# EAGLE schematic power (EAGLE 6.4)
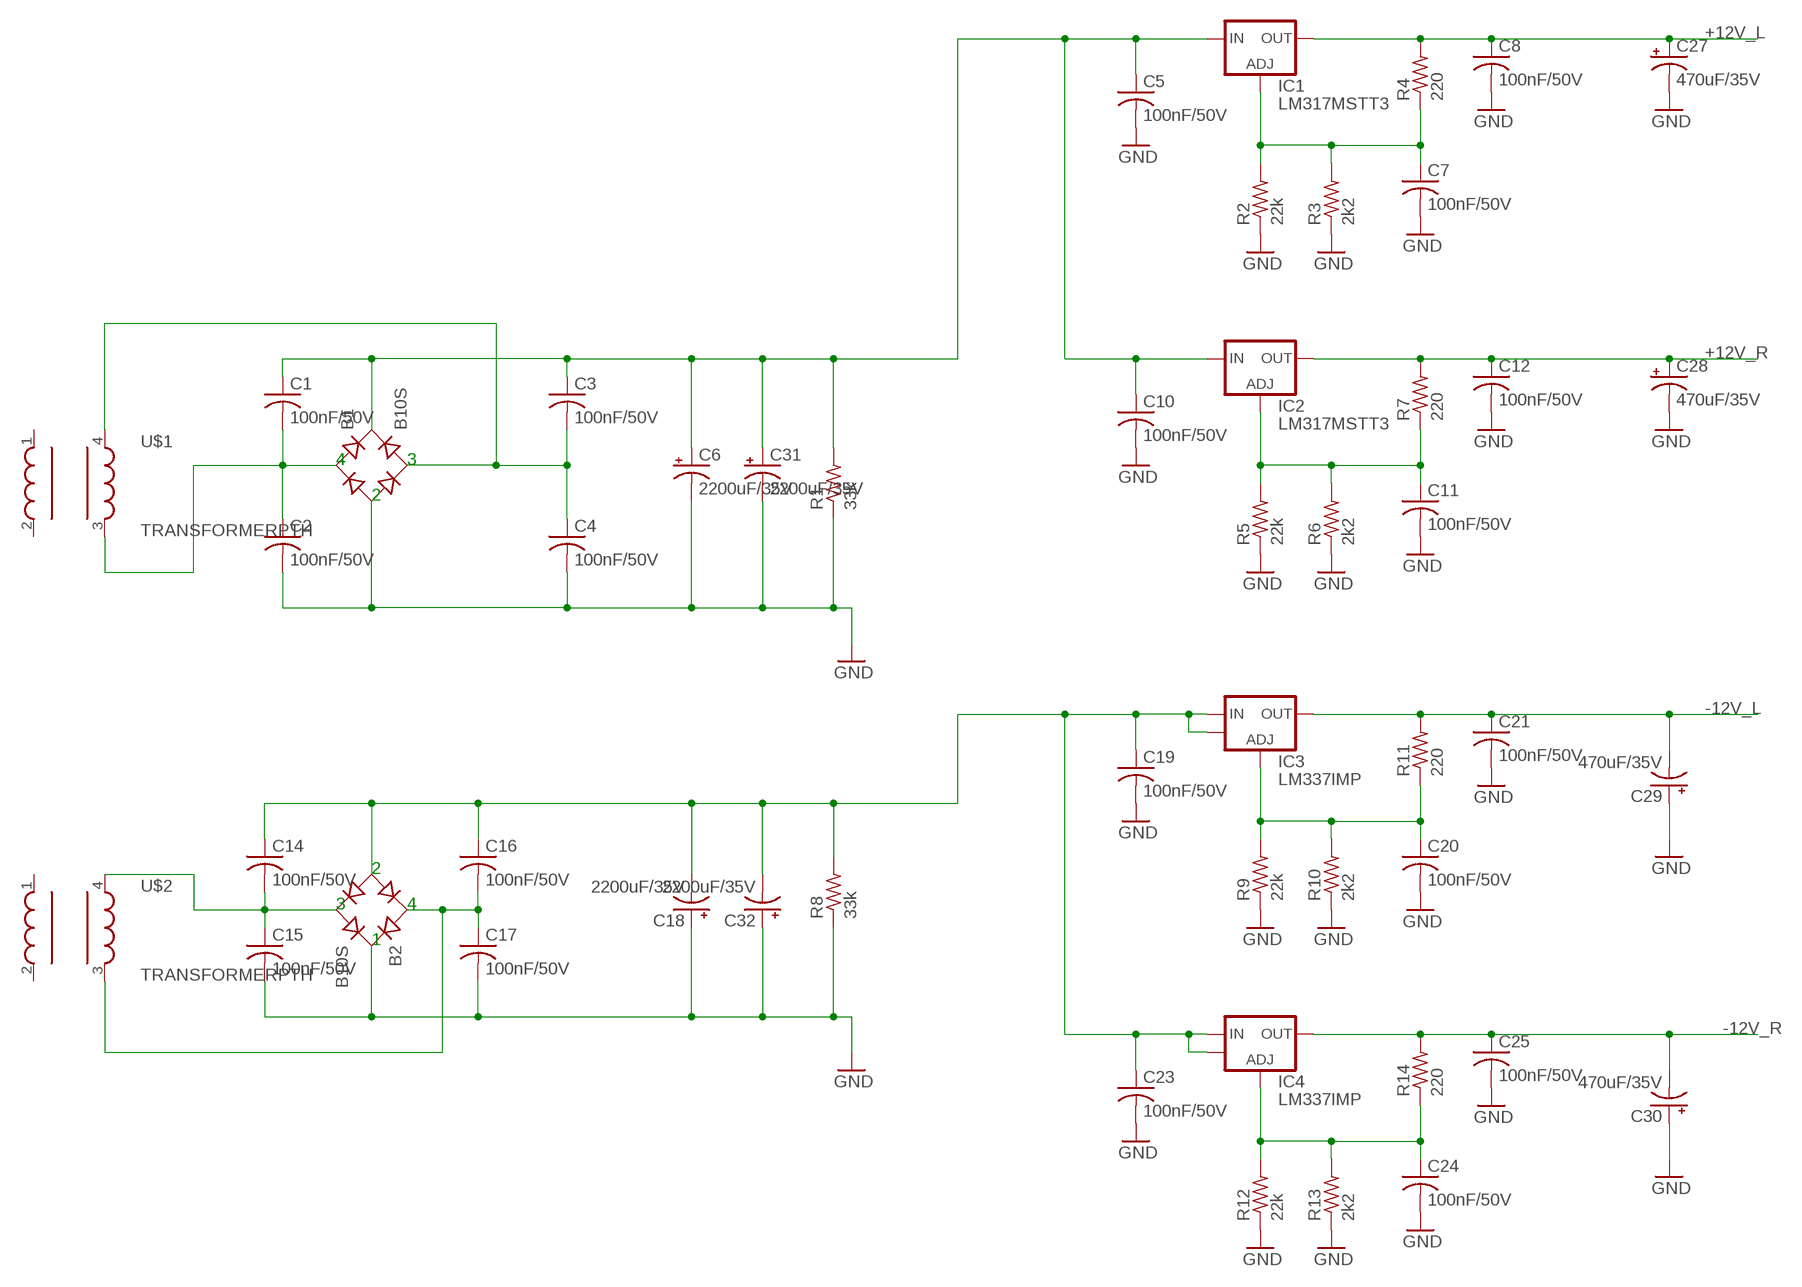
[diagram p0: schematic, sheet 1]

## Parts
B1  B10S  [MBS]
B2  B10S  [MBS]
C1  100nF/50V  C-USC0805  [C0805]
C2  100nF/50V  C-USC0805  [C0805]
C3  100nF/50V  C-USC0805  [C0805]
C4  100nF/50V  C-USC0805  [C0805]
C5  100nF/50V  C-USC0805  [C0805]
C6  2200uF/35V  CPOL-USE5-13  [E5-13]
C7  100nF/50V  C-USC0805  [C0805]
C8  100nF/50V  C-USC0805  [C0805]
C10  100nF/50V  C-USC0805  [C0805]
C11  100nF/50V  C-USC0805  [C0805]
C12  100nF/50V  C-USC0805  [C0805]
C14  100nF/50V  C-USC0805  [C0805]
C15  100nF/50V  C-USC0805  [C0805]
C16  100nF/50V  C-USC0805  [C0805]
C17  100nF/50V  C-USC0805  [C0805]
C18  2200uF/35V  CPOL-USE5-13  [E5-13]
C19  100nF/50V  C-USC0805  [C0805]
C20  100nF/50V  C-USC0805  [C0805]
C21  100nF/50V  C-USC0805  [C0805]
C23  100nF/50V  C-USC0805  [C0805]
C24  100nF/50V  C-USC0805  [C0805]
C25  100nF/50V  C-USC0805  [C0805]
C27  470uF/35V  CPOL-USE5-13  [E5-13]
C28  470uF/35V  CPOL-USE5-13  [E5-13]
C29  470uF/35V  CPOL-USE5-13  [E5-13]
C30  470uF/35V  CPOL-USE5-13  [E5-13]
C31  2200uF/35V  CPOL-USE5-13  [E5-13]
C32  2200uF/35V  CPOL-USE5-13  [E5-13]
IC1  LM317MSTT3  [SOT223]
IC2  LM317MSTT3  [SOT223]
IC3  LM337IMP  [SOT-223]
IC4  LM337IMP  [SOT-223]
R1  33k  R-US_M0805  [M0805]
R2  22k  R-US_M0805  [M0805]
R3  2k2  R-US_M0805  [M0805]
R4  220  R-US_M0805  [M0805]
R5  22k  R-US_M0805  [M0805]
R6  2k2  R-US_M0805  [M0805]
R7  220  R-US_M0805  [M0805]
R8  33k  R-US_M0805  [M0805]
R9  22k  R-US_M0805  [M0805]
R10  2k2  R-US_M0805  [M0805]
R11  220  R-US_M0805  [M0805]
R12  22k  R-US_M0805  [M0805]
R13  2k2  R-US_M0805  [M0805]
R14  220  R-US_M0805  [M0805]
U$1  TRANSFORMERPTH  [TRANSFORMER]
U$2  TRANSFORMERPTH  [TRANSFORMER]

## Nets
+12V_L: C8.1 C27.+ IC1.4(OUT) R4.2
+12V_R: C12.1 C28.+ IC2.4(OUT) R7.2
+VSS_NOREG: B1.+ C1.1 C3.1 C5.1 C6.+ C10.1 C31.+ IC1.3(IN) IC2.3(IN) R1.2
-12V_L: C21.1 C29.- IC3.3(OUT) R11.2
-12V_R: C25.1 C30.- IC4.3(OUT) R14.2
-VSS_NOREG: B2.- C14.1 C16.1 C18.- C19.1 C23.1 C32.- IC3.2(IN) IC3.4 IC4.2(IN) IC4.4 R8.2
GND: B1.- B2.+ C2.2 C4.2 C5.2 C6.- C7.2 C8.2 C10.2 C11.2 C12.2 C15.2 C17.2 C18.+ C19.2 C20.2 C21.2 C23.2 C24.2 C25.2 C27.- C28.- C29.+ C30.+ C31.- C32.+ R1.1 R2.1 R3.1 R5.1 R6.1 R8.1 R9.1 R10.1 R12.1 R13.1
N$1: B1.AC1 C1.2 C2.1 U$1.3
N$2: B1.AC2 C3.2 C4.1 U$1.4
N$4: B2.AC2 C14.2 C15.1 U$2.4
N$7: C7.1 IC1.1(ADJ) R2.2 R3.2 R4.1
N$8: C11.1 IC2.1(ADJ) R5.2 R6.2 R7.1
N$11: B2.AC1 C16.2 C17.1 U$2.3
N$14: C20.1 IC3.1(ADJ) R9.2 R10.2 R11.1
N$17: C24.1 IC4.1(ADJ) R12.2 R13.2 R14.1
Unconnected: U$1.1 U$1.2 U$2.1 U$2.2

## Notes on the sheet
- 4 | 3
- 2
- 2
- 3 | 4
- 1

## Library data of the parts
B1 B2 = rectifier:B*S: Surface Mount Glass Passivated Bridge Rectifiers Source: Comchip Bridge Rectifiers B05S-G_B10S-G.pdf
C1-C5 C7 C8 C10-C12 C14-C17 C19-C21 C23-C25 = rcl:C-US: CAPACITOR, American symbol
C6 C18 C27-C32 = rcl:CPOL-US: POLARIZED CAPACITOR, American symbol
IC1 IC2 = v-reg:LM317?*: 500 mA Adjustable Output Positive Voltage Regulator Source: http://www.onsemi.co.jp .. LM317M-D.PDF
IC3 IC4 = AWJLEagleLib:LM337: LM337 adjustable negative voltage regulator
R1-R14 = rcl:R-US_: RESISTOR, American symbol
U$1 U$2 = SparkFun-PowerIC:TRANSFORMER: Small transformers